# EAGLE design working (EAGLE 9.5.1)
COMPANY: ADAFRUIT INDUSTRIES; DRAWN: KTOWN; REV: A; YEAR: 2019
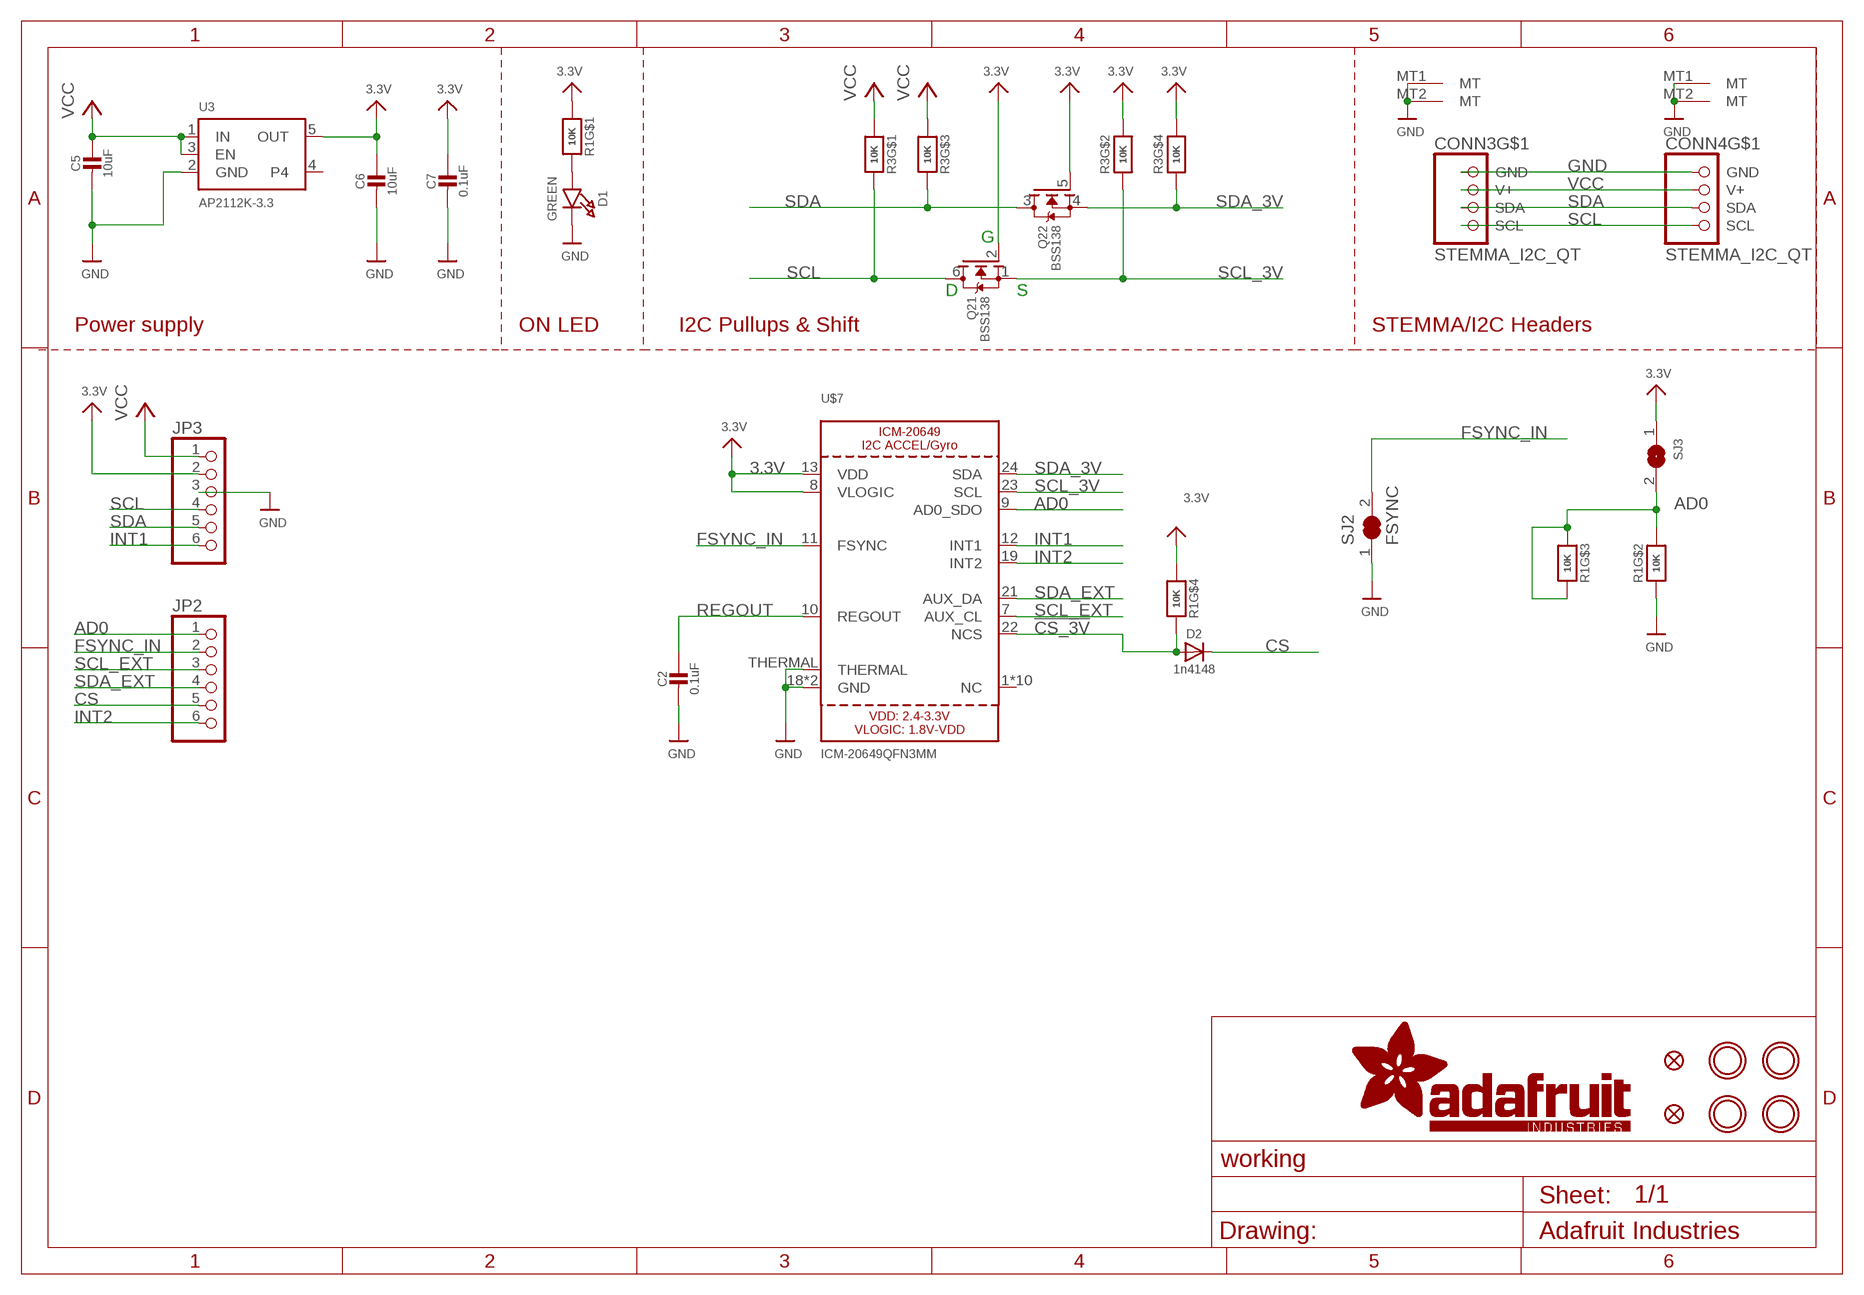
[diagram p0: schematic, sheet 1]

## Parts
C2  0.1uF  CAP_CERAMIC0603_NO  [0603-NO]
C5  10uF  CAP_CERAMIC0805-NOOUTLINE  [0805-NO]
C6  10uF  CAP_CERAMIC0805-NOOUTLINE  [0805-NO]
C7  0.1uF  CAP_CERAMIC0603_NO  [0603-NO]
CONN3  STEMMA_I2C_QT  [JST_SH4]
CONN4  STEMMA_I2C_QT  [JST_SH4]
D1  GREEN  LED0603_NOOUTLINE  [CHIPLED_0603_NOOUTLINE]
D2  1n4148  DIODESOD-323  [SOD-323]
FID3  FIDUCIAL_1MM  [FIDUCIAL_1MM]
FID4  FIDUCIAL_1MM  [FIDUCIAL_1MM]
JP2  HEADER-1X6ROUND  [1X06_ROUND]
JP3  HEADER-1X670MIL  [1X06_ROUND_70]
Q2  BSS138  MOSFET-N_DUAL  [SOT363]
R1  10K  RESISTOR_4PACK  [RESPACK_4X0603]
R3  10K  RESISTOR_4PACK  [RESPACK_4X0603]
SJ2  FSYNC  SOLDERJUMPER_CLOSED  [SOLDERJUMPER_CLOSEDWIRE]
SJ3  SOLDERJUMPER  [SOLDERJUMPER_ARROW_NOPASTE]
U3  AP2112K-3.3  VREG_SOT23-5  [SOT23-5]
U$7  ICM-20649QFN3MM  [QFN24_3MM]
U$39  MOUNTINGHOLE2.5  [MOUNTINGHOLE_2.5_PLATED]
U$40  MOUNTINGHOLE2.5  [MOUNTINGHOLE_2.5_PLATED]
U$42  MOUNTINGHOLE2.5  [MOUNTINGHOLE_2.5_PLATED]
U$43  MOUNTINGHOLE2.5  [MOUNTINGHOLE_2.5_PLATED]

## Nets
3.3V: C6.1 C7.1 JP3.2 Q2.2(1:G) Q2.5(2:G) R1.1 R1.4 R3.2 R3.4 SJ3.1 U3.5(OUT) U$7.8(VLOGIC) U$7.13(VDD)
!CS_3V: D2.A R1.5 U$7.22(NCS)
AD0: JP2.1 R1.3 R1.6 R1.7 SJ3.2 U$7.9(AD0_SDO)
CS: D2.C JP2.5
FSYNC_IN: JP2.2 SJ2.2 U$7.11(FSYNC)
GND: C2.2 C5.2 C6.2 C7.2 CONN3.1(GND) CONN3.MT1(MT) CONN3.MT2(MT) CONN4.1(GND) CONN4.MT1(MT) CONN4.MT2(MT) D1.C JP3.3 R1.2 SJ2.1 U3.2(GND) U$7.18(GND) U$7.20(GND) U$7.THERMAL
INT1: JP3.6 U$7.12(INT1)
INT2: JP2.6 U$7.19(INT2)
N$1: D1.A R1.8
REGOUT: C2.1 U$7.10(REGOUT)
SCL: CONN3.4(SCL) CONN4.4(SCL) JP3.4 Q2.6(1:D) R3.8
SCL_3V: Q2.1(1:S) R3.7 U$7.23(SCL)
SCL_EXT: JP2.3 U$7.7(AUX_CL)
SDA: CONN3.3(SDA) CONN4.3(SDA) JP3.5 Q2.3(2:D) R3.6
SDA_3V: Q2.4(2:S) R3.5 U$7.24(SDA)
SDA_EXT: JP2.4 U$7.21(AUX_DA)
VCC [highpower]: C5.1 CONN3.2(V+) CONN4.2(V+) JP3.1 R3.1 R3.3 U3.1(IN) U3.3(EN)
Unconnected: U3.4 U$7.1(NC) U$7.2(NC) U$7.3(NC) U$7.4(NC) U$7.5(NC) U$7.6(NC) U$7.14(NC) U$7.15(NC) U$7.16(NC) U$7.17(NC)

## Notes on the sheet
- G
- D | S
- Power supply | ON LED | I2C Pullups & Shift | STEMMA/I2C Headers

## Library data of the parts
C2 C5-C7 = microbuilder:CAP_CERAMIC: Ceramic Capacitors For new designs, use the packages preceded by an '_' character since they are more reliable: The following footprints should be used on most boards: _0402 - Standard footprint for regular board layouts _0603 - Standard footprint for regular board layouts _0805 - Standard footprint for regular board layouts _1206 - Standard footprint for regular board layouts For extremely tight-pitch boards where space is at a premium, the following 'micro-pitch' footprints can be used (smaller pads, no silkscreen outline, etc.): _0402MP - Micro-pitch footprint for very dense/compact boards _0603MP - Micro-pitch footprint for very dense/compact boards _0805MP - Micro-pitch footprint for very dense/compact boards _1206MP - Micro-pitch footprint for very dense/compact boards
CONN3 CONN4 = microbuilder:STEMMA_I2C
D1 = microbuilder:LED: LED 0603 - 0603 Surface Mount Package 2mA: Green LED - Low Power (3.9mcd, 2ma, 1.7Vf) - Digikey: 475-2709-2-ND Orange LED - Low Power (9.8mcd, 2ma, 1.8Vf) - Digikey: 475-1194-2-ND Red LED - Low Power (5mcd, 2ma, 1.8Vf) - Digikey: 475-1195-2-ND Yellow LED - Low Power (7mcd, 2ma, 1.8Vf) - Digikey: 475-1196-2-ND 5mA: Blue LED - Low Power (17mcd, 5ma, 2.9Vf) - Digikey: LNJ937W8CRACT-ND 0805 - 0805 Surface Mount Package 2mA: Red LED (8.8mcd, 2mA, 1.8Vf, Clear) - Low Power [Digikey: 475-2510-1-ND] Green LED (5mcd, 2mA, 1.8Vf, Clear) - Low Power [Digikey: 475-2730-1-ND] Yellow LED (11.3mcd, 2mA, 1.8Vf, Clear) - Low Power [Digikey: 475-2555-1-ND] 20mA: Red LED (104mcd, 20mA, Diffused) - LS R976 [Digikey: 475-1278-6-ND] Red LED (12mcd, 20mA, 2.0Vf, Clear) - APT2012EC [Digikey: 754-1128-1-ND] Green LED (15mcd, 20mA, 2.2Vf, Clear) - APT2012GC [Digikey: 754-1131-1-ND] Orange LED (160mcd, 20mA, 2.1Vf, Clear) - APT2012SECK [Digikey: 754-1130-1-ND] 1206 - 1206 Surface Mount Package Green LED (26mcd, 20mA, Diffused) - LG N971 [Digikey: 475-1407-6-ND] Red LED (15mcd, 20mA, Diffused) - LH N974 [Digikey: 475-1416-6-ND] Cree - Cree High-Power Surface Mount LEDs XPEBWT-L1-0000-00D50 - White 111lm 350mA 2.9Vf 6200K 110° XTEAWT-00-0000-00000LEE3 - White 114lm 350mA 2.85Vf 5000K 115° Everlight - Everlight 45-21 Series Surface Mount LEDs 45-21/QK2C-B2832AC2CB2/2T - Warm White 2000mcd 20mA 3.25Vf 3050K 120° 45-21/LK2C-B38452C4CB2/2T - Nuetral White 2000mcd 20mA 3.25Vf 4150K 120° 45-21/LK2C-B50634C6CB2/2T - Cold White 2200mcd 20mA 3.25Vf 5650K 120° PLCC2 Reverse Mount LS T77K-J1L2-1-0-2-R18-Z - Red 11.25mcd 2mA 1.8Vf 630nm 120° LO T77K-L1M2-24-Z - Orange 19.6mcd 2mA 1.8Vf 606nm 120° LY T77K-K2M1-26-Z - Yellow 15.7mcd 2mA 1.8Vf 587nm 120°
D2 = microbuilder:DIODE: Diode SMA Model Volts Amps Type Vf Ir Digikey # Notes SSA34-E3 40V 3A Schottky 480mV @ 3A 200uA @ 40V SSA34-E3/61TGITR-ND CDBA120-G 20V 1A Schottky 500mV @ 1A 500uA @ 20V 641-1014-6-ND REEL MBRA210 10V 2A Schottky 350mV @ 2A 700uA @ 10V MBRA210LT3 SOD-123 Model Volts Amps Type Vf Ir Order # Notes BAT54T1G 30V 200mA Schottky 800mV @ 200mA 2uA @ 25V BAT54T1GOSTR-ND B0530W 30V 500mA Schottky 430mV @ 500mA 130uA @ 30V B0530W-FDICT-ND REEL MBR120 20V 1A Schottky 340mV @ 1A MBR120VLSFT1GOSCT-ND SOD-323 Model Volts Amps Type Vf Ir Order # Notes PMEG2005EJ 20V 500mA Schottky 355mV @ 500mA 568-4110-1-ND ZLLS410 10V 570mA Schottky 380mV @ 570mA ZLLS410CT-ND 1N4148WS 75V 150mA Silicon/Simple 1V 1N4148WSFSCT-ND REEL SOD-523 Model Volts Amps Type Vf Ir Order # Notes BAT54XV2 30V 200mA Schottky 0.8V @ 100mA BAT54XV2CT-ND TB751S 30V 30mA Schottky RB751S-40TE61CT-ND SOT23-R/W (R = Solder Paste/Reflow Ovens, W = Hand-Soldering) Model Volts Amps Type Vf Ir Order # Notes BAT54FILM 40V 300mA Schottky 497-7162-1-ND POWERDI-5 Model Volts Amps Type Vf Ir Order # Notes PDS560 60V 5A Schottky 670mV @ 5A 150uA @ 60V PDS560DICT-ND
FID3 FID4 = microbuilder:FIDUCIAL: Fiducial Alignment Points Various fiducial points for machine vision alignment.; BOM: EXCLUDE
JP2 JP3 = microbuilder:HEADER-1X6: PIN HEADER
Q2 = microbuilder:MOSFET-N_DUAL: Dual N-Channel MOSFET SOT363 (2.0x1.25mm) 2N7002PS - 60V, 320mA [Digikey: 568-5984-1-ND]
R1 R3 = microbuilder:RESISTOR_4PACK: Resistor Packs (4 resistors) 4 x 0603 10K 1/16W - Digikey: YC164J-10KCT-ND
SJ2 = microbuilder:SOLDERJUMPER_CLOSED: Solder Jumper - Closed These solder jumpers are closed by default CLOSEDWIRE - 10 mil trace between pads that can be cut and resoldered later CLOSEDPERM - 63 mil trace between pads for a permanent connection (used to 'bridge' two signals, a shameless hack for Eagle). Can double as a test point as well (no cream layer)
SJ3 = microbuilder:SOLDERJUMPER: SMD Solder JUMPER Solder the two pads together to create a connection, or remove the solder to break it. REFLOW - Use this footprint for solder paste and reflow ovens. WAVE - Use this footprint for hand-soldering (larger pads). CLOSED - Has a trace between the two pads to ensure it is closed by default. The trace needs to be cut to disable the jumper, and can be closed again by creating a solder bridge between the two pads.; BOM: EXCLUDE
U3 = microbuilder:VREG_SOT23-5: SOT23-5 Fixed Voltage Regulators Part Current Out V Out V In V Dropout θJA (°C/W) TJ (°C) Digikey Part No. ADP121 150mA 3.3V 3.4-5.5V 0.09V @ 150mA -- -- ADP121-AUJZ33R7CT-ND ADP121 150mA 3.0V 3.1-5.5V 0.09V @ 150mA -- -- ADP121-AUJZ30R7CT-ND ADP122 300mA 3.3V 3.4-5.5V 0.085V @ 300mA -- -- ADP122AUJZ-3.3-R7CT-ND ADP1712 300mA 3.3V 3.5-5.5V 0.17V @ 300mA -- -- ADP1712AUJZ-3.3-R7TR-ND AP7311 (Low Cost) 150mA 3.3V 3.5-6V 0.15V @ 150mA -- -- AP7311-33WG-7DICT-ND LD39015M18R 150mA 1.8V 1.9V-5.5V 0.08V @ 100mA -- -- 497-6977-1-ND LP2985A-33DBVR 150mA 3.3V 3.3-16V 0.28V @ 150mA 206 150 296-18479-1-ND MCP1824T-3302E/OT 300mA 3.3V 3.5V-6V 0.2V @ 300mA -- -- MCP1824T-3302E/OTCT-ND MIC5205-2.5YM5 TR 150mA 2.5V 2.7-16V 0.165V @ 150mA -- -- 576-1257-2-ND MIC5205-3.0YM5 TR 150mA 3.0V 3.2V-16V 0.165V @ 150mA -- -- 576-1258-2-ND MIC5205-3.3YM5 TR 150mA 3.3V 3.5V-16V 0.165V @ 150mA -- -- 576-1259-2-ND TPS780330220 150mA 3.3V+2.2V 3.6-5.5V 250mV Max -- -- 296-23332-1-ND TDA3663/N1,135 100mA 3.3V 3.5-45V 0.18V @ 50mA -- -- 568-5343-1-ND Max operating temp can be calculated using θJA, TJ (max junction temperature), and power in watts. Set the "Maximum Ambient Temperature" until it reaches TJ ("Max Junction Temperature"), which is the absolute limit for safe use of the regulator: Heat Sink Temperature Calculator <http://www.daycounter.com/Calculators/Heat-Sink-Temperature-Calculator.phtml> For example, With 12V source into a 3.3V LP2985 and a 30mA load, we are dissipating (12V-3.3V) * 0.03A = 0.261W. With a θJA of 206 °C/W, a TJ of 150°C, and 261mW we can safely use the chip without a heat sink up to 75°C (=147.1°C Junction Temperature).
U$7 = microbuilder:ICM-20649
U$39 U$40 U$42 U$43 = microbuilder:MOUNTINGHOLE: Mounting Hole For #2 screws (0.086"/2.18mm width, 0.094"/2.4mm hole) use 2.5mm; BOM: EXCLUDE

## Net classes
1 highpower: width 0.406 mm, drill 0.483 mm
2 lowpower: width 0.305 mm, drill 0.483 mm

## Board
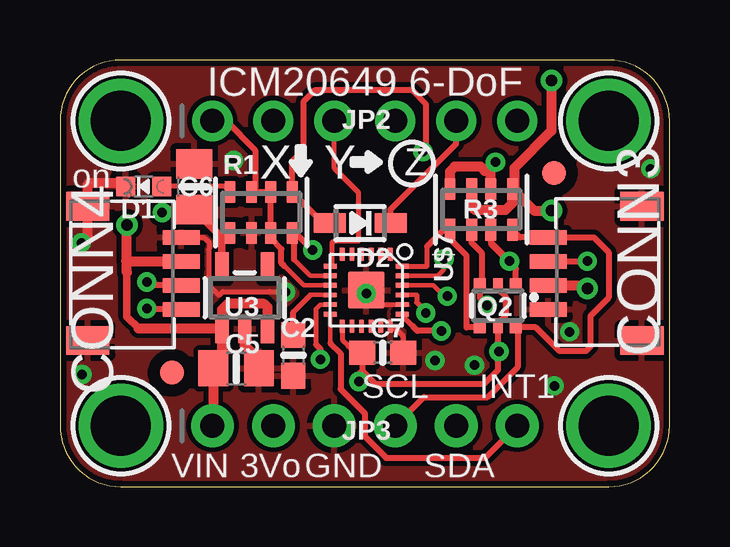
[diagram p1: board, top side]
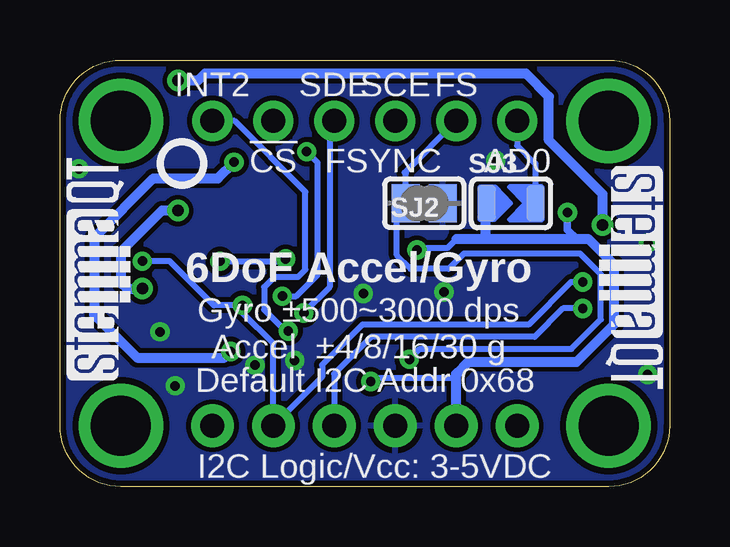
[diagram p2: board, bottom side, seen from below]

Size 25.4 x 17.78 mm. Coordinates in mm from the lower left corner, seen from the top.
Outline: 0,15.24 0,2.54 arc90 2.54,0 22.86,0 arc90 25.4,2.54 25.4,15.24 arc90 22.86,17.78 2.54,17.78 arc90 0,15.24
Copper layers (1*16): Top 0.035mm / dielectric 1.5mm / Bottom 0.035mm
Design rules "adafruit 7-7": minimum track width 6mil, minimum drill 15.5mil, track to track 8mil, track to pad 7mil, pad to pad 7mil, via to via 7mil, smd to smd 7mil, copper to edge 10mil, drill to drill 8mil, minimum pad ring 10mil, minimum via ring 8mil, stop-mask expansion 2mil, vias tented up to drill 20mil, thermal gap 10mil

### Footprints (pad centres in the part's own frame; a part is rotated, then mirrored left to right if it is on the bottom)
0603-NO = smd 1.075 x 1: 1 -0.85,0; 2 0.85,0
0805-NO = smd 1.24 x 1.5: 1 -0.95,0; 2 0.95,0
JST_SH4 = smd 0.6 x 1.55: 1 -1.5,2.514; 2 -0.5,2.514; 3 0.5,2.514; 4 1.5,2.514 | smd 1.2 x 1.8: MT1 -2.8,-1.386; MT2 2.8,-1.386
CHIPLED_0603_NOOUTLINE = smd 0.8 x 0.8: A 0,-0.75; C 0,0.75
SOD-323 = smd 1.35 x 0.8: A 1.27,0; C -1.27,0
FIDUCIAL_1MM = smd 1 x 1: 1 0,0
1X06_ROUND = drill 1 pad 1.676: 1 -6.35,0; 2 -3.81,0; 3 -1.27,0; 4 1.27,0; 5 3.81,0; 6 6.35,0
1X06_ROUND_70 = drill 1 pad 1.778: 1 -6.35,0; 2 -3.81,0; 3 -1.27,0; 4 1.27,0; 5 3.81,0; 6 6.35,0
SOT363 = smd 0.5 x 0.5: 1 -0.75,-0.9; 3 0.75,-0.9; 4 0.75,0.9; 6 -0.75,0.9 | smd 0.4 x 0.5: 2 0,-0.9; 5 0,0.9
RESPACK_4X0603 = smd 0.45 x 0.9: 1 -1.3,-0.85; 2 -0.4,-0.85; 3 0.4,-0.85; 4 1.3,-0.85; 5 1.3,0.85; 6 0.4,0.85; 7 -0.4,0.85; 8 -1.3,0.85
SOLDERJUMPER_CLOSEDWIRE = smd 1.168 x 1.6: 1 -0.762,0; 2 0.762,0 | smd 0.635 x 0.203: WIRE 0,0
SOLDERJUMPER_ARROW_NOPASTE = smd 0.762 x 1.524: 1 -1.016,0; 2 1.016,0
SOT23-5 = smd 0.55 x 1.2: 1 -0.95,-1.3; 2 0,-1.3; 3 0.95,-1.3; 4 0.95,1.3; 5 -0.95,1.3
QFN24_3MM = smd 0.55 x 0.2: 1 -1.5,1; 2 -1.5,0.6; 3 -1.5,0.2; 4 -1.5,-0.2; 5 -1.5,-0.6; 6 -1.5,-1; 13 1.5,-1; 14 1.5,-0.6; 15 1.5,-0.2; 16 1.5,0.2; 17 1.5,0.6; 18 1.5,1 | smd 0.2 x 0.55: 7 -1,-1.5; 8 -0.6,-1.5; 9 -0.2,-1.5; 10 0.2,-1.5; 11 0.6,-1.5; 12 1,-1.5; 19 1,1.5; 20 0.6,1.5; 21 0.2,1.5; 22 -0.2,1.5; 23 -0.6,1.5; 24 -1,1.5 | smd 1.54 x 1.54: THERMAL 0,0
MOUNTINGHOLE_2.5_PLATED = drill 2.5 pad 3.2: P$1 0,0

### Placement (x,y rotation side)
C2  9.73,5.47 270 top
C5  7.34,4.93 0 top
C6  5.59,12.5 90 top
C7  13.45,5.59 0 top
CONN3  22.86,8.89 90 top
CONN4  2.54,8.89 270 top
D1  3.49,12.51 90 top
D2  12.51,10.99 180 top
FID3  20.57,13.08 0 top
FID4  4.66,4.75 0 top
JP2  12.7,15.24 0 top
JP3  12.7,2.54 0 top
Q2  18.25,7.54 180 top
R1  8.38,11.43 0 top
R3  17.55,11.56 180 top
SJ2  10.22,11.81 180 bottom
SJ3  6.6,11.81 0 bottom
U3  7.7,7.87 0 top
U$7  12.76,8.19 270 top
U$39  2.54,15.24 0 top
U$40  22.86,15.24 0 top
U$42  2.54,2.54 0 top
U$43  22.86,2.54 0 top
U$46  [PCBFEAT-REV-040]  20.32,13.46 0 bottom
U$47  [STEMMAQT]  22.48,4.45 90 bottom
U$48  [STEMMAQT]  2.92,13.34 270 bottom

### Tracks (layer width: path | path; a pad name or v marks a point on that pad's centre or on a via)
3.3V  (via drill 0.39)
  Top 0.178: U$7.8 10.43,8.79 9.74,9.48
  Top 0.203: U$7.13 11.76,6.13 12.03,5.87
  Top 0.254: 12.6,4.83 13.16,4.26 17.65,4.26 18.25,4.86 18.25,5.6 | 12.6,4.83 C7.1 12.31,5.59 12.03,5.87 | Q2.2 18.25,8.25 18.57,7.94 18.57,7.15 18.25,6.83 Q2.5 18.25,5.6 | 12.6,4.83 12.45,4.68 v12.45,4.38 | v18.29,5.64 18.25,5.6 | 9.74,9.48 9.74,10.52 R1.4 9.81,10.58 v10.53,9.86
  Top 0.305: U3.5 6.75,10.24 | 6.75,10.24 R1.1 | 6.75,10.24 6.75,10.39 C6.1 4.38,11.55 v4.25,11.43
  Top 0.406: R3.4 16.25,13.14 16.44,13.34 17.53,13.34 17.7,13.16 17.95,13.42 | R3.2 17.95,13.42 | 17.95,13.42 18.1,13.57 v18.15,13.53
  Bottom 0.254: v12.45,4.38 12.28,4.55 9.04,4.55 8.86,4.73 | v10.53,9.86 10.44,9.95 9.25,9.95 8.87,10.33
  Bottom 0.305: 3.87,10.33 4.25,10.71 v4.25,11.43
  Bottom 0.406: v18.29,5.64 18.54,5.38 22.18,5.38 23.97,7.17 23.97,10.38 21.5,12.85 18.83,12.85 v18.15,13.53 | JP3.2 8.89,4.7 8.86,4.73 8.38,5.21 3.87,5.21 2.31,6.76 2.31,9.25 3.39,10.33 3.87,10.33 6.1,10.33 7.75,10.33 | 8.87,10.33 7.75,10.33 | SJ3.1 7.68,11.75 7.68,10.39 7.75,10.33
!CS_3V  (via drill 0.39)
  Top 0.178: U$7.22 15.55,8.39 15.88,8.06
  Top 0.203: v16.14,7.94 16.01,8.06 15.88,8.06
  Top 0.254: v15.12,13.96 15.25,14.09 15.25,15.93 14.67,16.51 10.6,16.51 10.16,16.07 10.16,14.03 9.68,13.56 R1.5 10.98,10.99 D2.A
  Bottom 0.254: v16.14,7.94 15.57,7.94 14.67,8.84 14.67,13.51 v15.12,13.96
AD0
  Top 0.178: U$7.9 10.15,8.39 9.34,9.2
  Top 0.254: JP2.1 6.92,15.24 8.13,14.03 8.13,12.43 R1.7 R1.6 R1.3 8.78,10.34 9.23,9.9 9.23,9.32 9.34,9.2
  Bottom 0.254: JP2.1 6.35,14.22 5.59,13.46 SJ3.2
CS
  Top 0.254: JP2.5 16.51,14.29 13.78,11.56 D2.C
FSYNC_IN  (via drill 0.39)
  Top 0.178: U$7.11 10.85,7.59 10.66,7.4
  Top 0.203: 10.66,7.4 10.66,5.93
  Top 0.254: 10.66,5.93 10.85,5.74 v10.85,5.31
  Bottom 0.254: v10.85,5.31 10.41,5.74 4.09,5.74 2.86,6.97 2.86,8.85 3.73,9.72 8.57,9.72 9.21,9.08 10.79,9.08 11.37,9.65 11.37,11.43 SJ2.2 10.99,13.04 11.04,13.09 JP2.2
GND  (via drill 0.39)
  Top 0.178: U$7.20 13.22,7.59
  Top 0.203: 13.22,7.59 v12.76,8.05 | 13.74,6.71 U$7.18 13.82,6.69 14.03,6.48 14.1,6.48 14.3,6.28 C7.2 | CONN4.1 5.99,10.39 6.22,10.16 6.22,9.92 6.19,9.89 6.19,8.48 6.16,8.45 6.63,7.98 6.78,8.13 8.72,8.13 8.73,8.12 v9.4,8.12
  Top 0.254: U$7.THERMAL v12.76,8.05
  Top 0.406: U3.2 7.7,5.89 8.29,5.3 C5.2 | D1.C 2.6,12.51 2.48,12.64 1.21,12.64 1.14,12.57 1.14,10.41 v0.89,10.16
  other vias: 0.91,4.67 21.23,6.45 24.61,13.25 7.24,13.59 20.6,4.2 17.27,5.07 15.62,5.26
  pour Top: 0,17.78 25.4,17.78 25.4,0 0,0
  pour Bottom: 0,17.78 25.4,17.78 25.4,0 0,0
INT1
  Top 0.178: U$7.12 11.26,5.99
  Top 0.254: 11.26,5.99 11.69,5.55 11.69,4.07 12.7,3.06 12.7,2.1 13.59,1.21 17.72,1.21 JP3.6
INT2  (via drill 0.39)
  Top 0.203: U$7.19 14.26,7.12 14.7,6.69
  Top 0.254: v15.89,6.49 14.89,6.49 14.7,6.69
  Bottom 0.254: JP2.6 18.13,15.24 15.18,12.29 15.18,9.04 15.49,8.73 16.48,8.73 16.89,8.31 16.89,7.38 15.95,6.43 v15.89,6.49
N$1
  Top 0.203: D1.A 6.85,12.51 R1.8
REGOUT
  Top 0.178: U$7.10 10.44,7.99
  Top 0.203: 10.44,7.99 9.73,7.28
  Top 0.254: C2.1 9.73,7.28
SCL  (via drill 0.39)
  Top 0.254: R3.8 19.17,10.39 CONN3.4 22.25,10.39 22.86,9.78 22.86,7.87 22.1,7.11 22.1,5.84 21.91,5.65 20.82,5.65 19.82,6.64 Q2.6 19.06,6.58 19.06,4.98 17.82,3.73 15.16,3.73 JP3.4 | CONN4.4 3.66,7.39 v3.62,7.43
  Bottom 0.254: v3.62,7.43 4.45,7.43 5.63,6.25 12.43,6.25 13.98,4.7 13.98,2.54 JP3.4
SCL_3V  (via drill 0.39)
  Top 0.178: v16,9.49 16,9.04 15.75,8.79 U$7.23
  Top 0.254: v18.73,9.4 17.95,10.18 R3.7 17.95,10.13 19,9.08 Q2.1
  Bottom 0.254: v16,9.49 16.09,9.4 v18.73,9.4
SCL_EXT
  Top 0.203: U$7.7 11.33,9.26 11.33,10.14 11.43,10.25 12.45,10.25 12.45,12.26 11.43,13.27 JP2.3
SDA  (via drill 0.39)
  Top 0.254: R3.6 17.15,10.17 17.57,9.76 17.57,8.51 Q2.3 17.5,7.86 v17.8,7.56 | CONN4.3 3.72,8.39 v3.62,8.53 | CONN3.3 v21.96,9.39 v21.97,9.4
  Bottom 0.254: v3.62,8.53 4.1,8.53 5.88,6.76 12.8,6.76 14.48,5.08 14.48,4.57 JP3.5 16.51,5.97 17.8,7.26 v17.8,7.56 18.99,7.56 20.83,9.4 v21.97,9.4
SDA_3V
  Top 0.203: U$7.24 15.29,9.19 15.29,10.01
  Top 0.254: 15.29,10.01 15.99,10.71 R3.5 16.25,10.31 16.95,9.62 16.95,6.64 Q2.4
SDA_EXT  (via drill 0.39)
  Top 0.178: U$7.21 14.86,7.99
  Top 0.203: 14.86,7.99 14.86,7.68 15.27,7.27
  Top 0.254: 15.27,7.27 v15.24,7.24
  Bottom 0.254: v15.24,7.24 14.16,8.32 14.16,15.05 JP2.4
VCC  (via drill 0.48)
  Top 0.305: 3.27,6.59 2.79,7.08 2.79,8.92
  Top 0.406: CONN4.2 4.99,9.45 4.5,9.45 4.45,9.4 2.76,9.4 | U3.3 8.65,7.48 8.51,7.62 6.99,7.62 6.75,7.38 U3.1 | U3.1 6.75,4.78 C5.1 6.39,2.91 6.18,2.88 6.35,2.71 JP3.1 | R3.3 17.15,11.68 17.29,11.54 18.57,11.54 18.85,11.82 R3.1 | R3.1 18.9,12.41 18.93,12.44 18.93,13.28 20.48,14.83 v20.48,16.92 | CONN3.2 21.84,8.39 v21.97,8.26 | 3.27,6.59 6.72,6.59 U3.1 | v2.79,10.91 2.76,10.87 2.76,9.4 | 2.79,8.92 2.79,9.37 2.76,9.4 | R3.1 19.75,11.51 v20.49,11.51
  Bottom 0.406: v2.79,10.91 2.79,12.19 5.03,14.43 5.03,16.26 5.98,17.21 19.37,17.21 19.65,16.92 v20.48,16.92 | v20.49,11.51 21.15,11.51 22.86,9.8 22.86,8.51 22.61,8.26 v21.97,8.26

### Text on the board
tPlace: ICM20649 6-DoF | X | Y | Z | on | SCL | INT1 | VIN | 3Vo | GND | SDA
bPlace: FS | SCE | SDE | INT2 | AD0 | FSYNC | !CS | 6DoF Accel/Gyro | Gyro ±500~3000 dps | Accel ±4/8/16/30 g | Default I2C Addr 0x68 | I2C Logic/Vcc: 3-5VDC